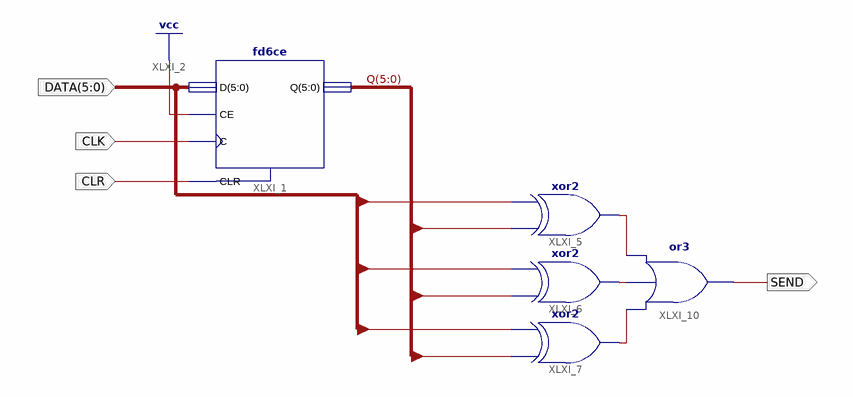
[diagram p0: schematic sheet 1]
// Xilinx ISE schematic ButtonPulseGenerator.sch (xc9500xl) as structural Verilog: 5 symbols, 4 ports
module ButtonPulseGenerator (
  input  [5:0] DATA,
  input  CLK,
  input  CLR,
  output SEND
);

  wire XLXN_24, XLXN_25, XLXN_26;
  wire [5:0] Q;

  fd6ce XLXI_1 (.C(CLK), .CE(1'b1), .CLR(CLR), .D(DATA), .Q(Q));
  xor XLXI_7 (XLXN_26, Q[2], DATA[2]);
  xor XLXI_6 (XLXN_24, Q[1], DATA[1]);
  xor XLXI_5 (XLXN_25, Q[0], DATA[0]);
  or XLXI_10 (SEND, XLXN_26, XLXN_24, XLXN_25);
endmodule
